# Altium schematic sheet PROC054D_Revision_History.SchDoc: Revision History
size 558 x 431 mm; Date: Not shown in title block; ApprovedBy: Not shown in title block; CheckedBy: Not shown in title block; Author: Not shown in title block; CompanyName: Not shown in title block; DrawnBy: a0271760; Engineer: Not shown in title block; Organization: Not shown in title block; Address1: Not shown in title block; Address2: Not shown in title block; Address3: Not shown in title block; Address4: Not shown in title block; DocumentNumber: 19; Revision: Use project pAWRameter SCH_Rev; SheetNumber: 19; SheetTotal: 19; PageSetup: Record=PageOptions|CenterHorizontal=True|CenterVertical=True|PrintScale=1.00|XCorrection=1.00|YCorrection=1.00|PrintKind=0|BorderSize=5000000|LeftOffset=0|BottomOffset=0|Orientation=2|PaperLength=1000|PaperWidth=1000|Scale=100|PaperSource=15|PrintQuality=600|MediaType=1|DitherType=10|PaperKind=Letter|PrintScaleMode=1; CurrentTime: Not shown in title block; CurrentDate: Not shown in title block; Time: Not shown in title block; DocumentFullPathAndName: Not shown in title block; DocumentName: Not shown in title block; ModifiedDate: Not shown in title block; ImagePath: Not shown in title block
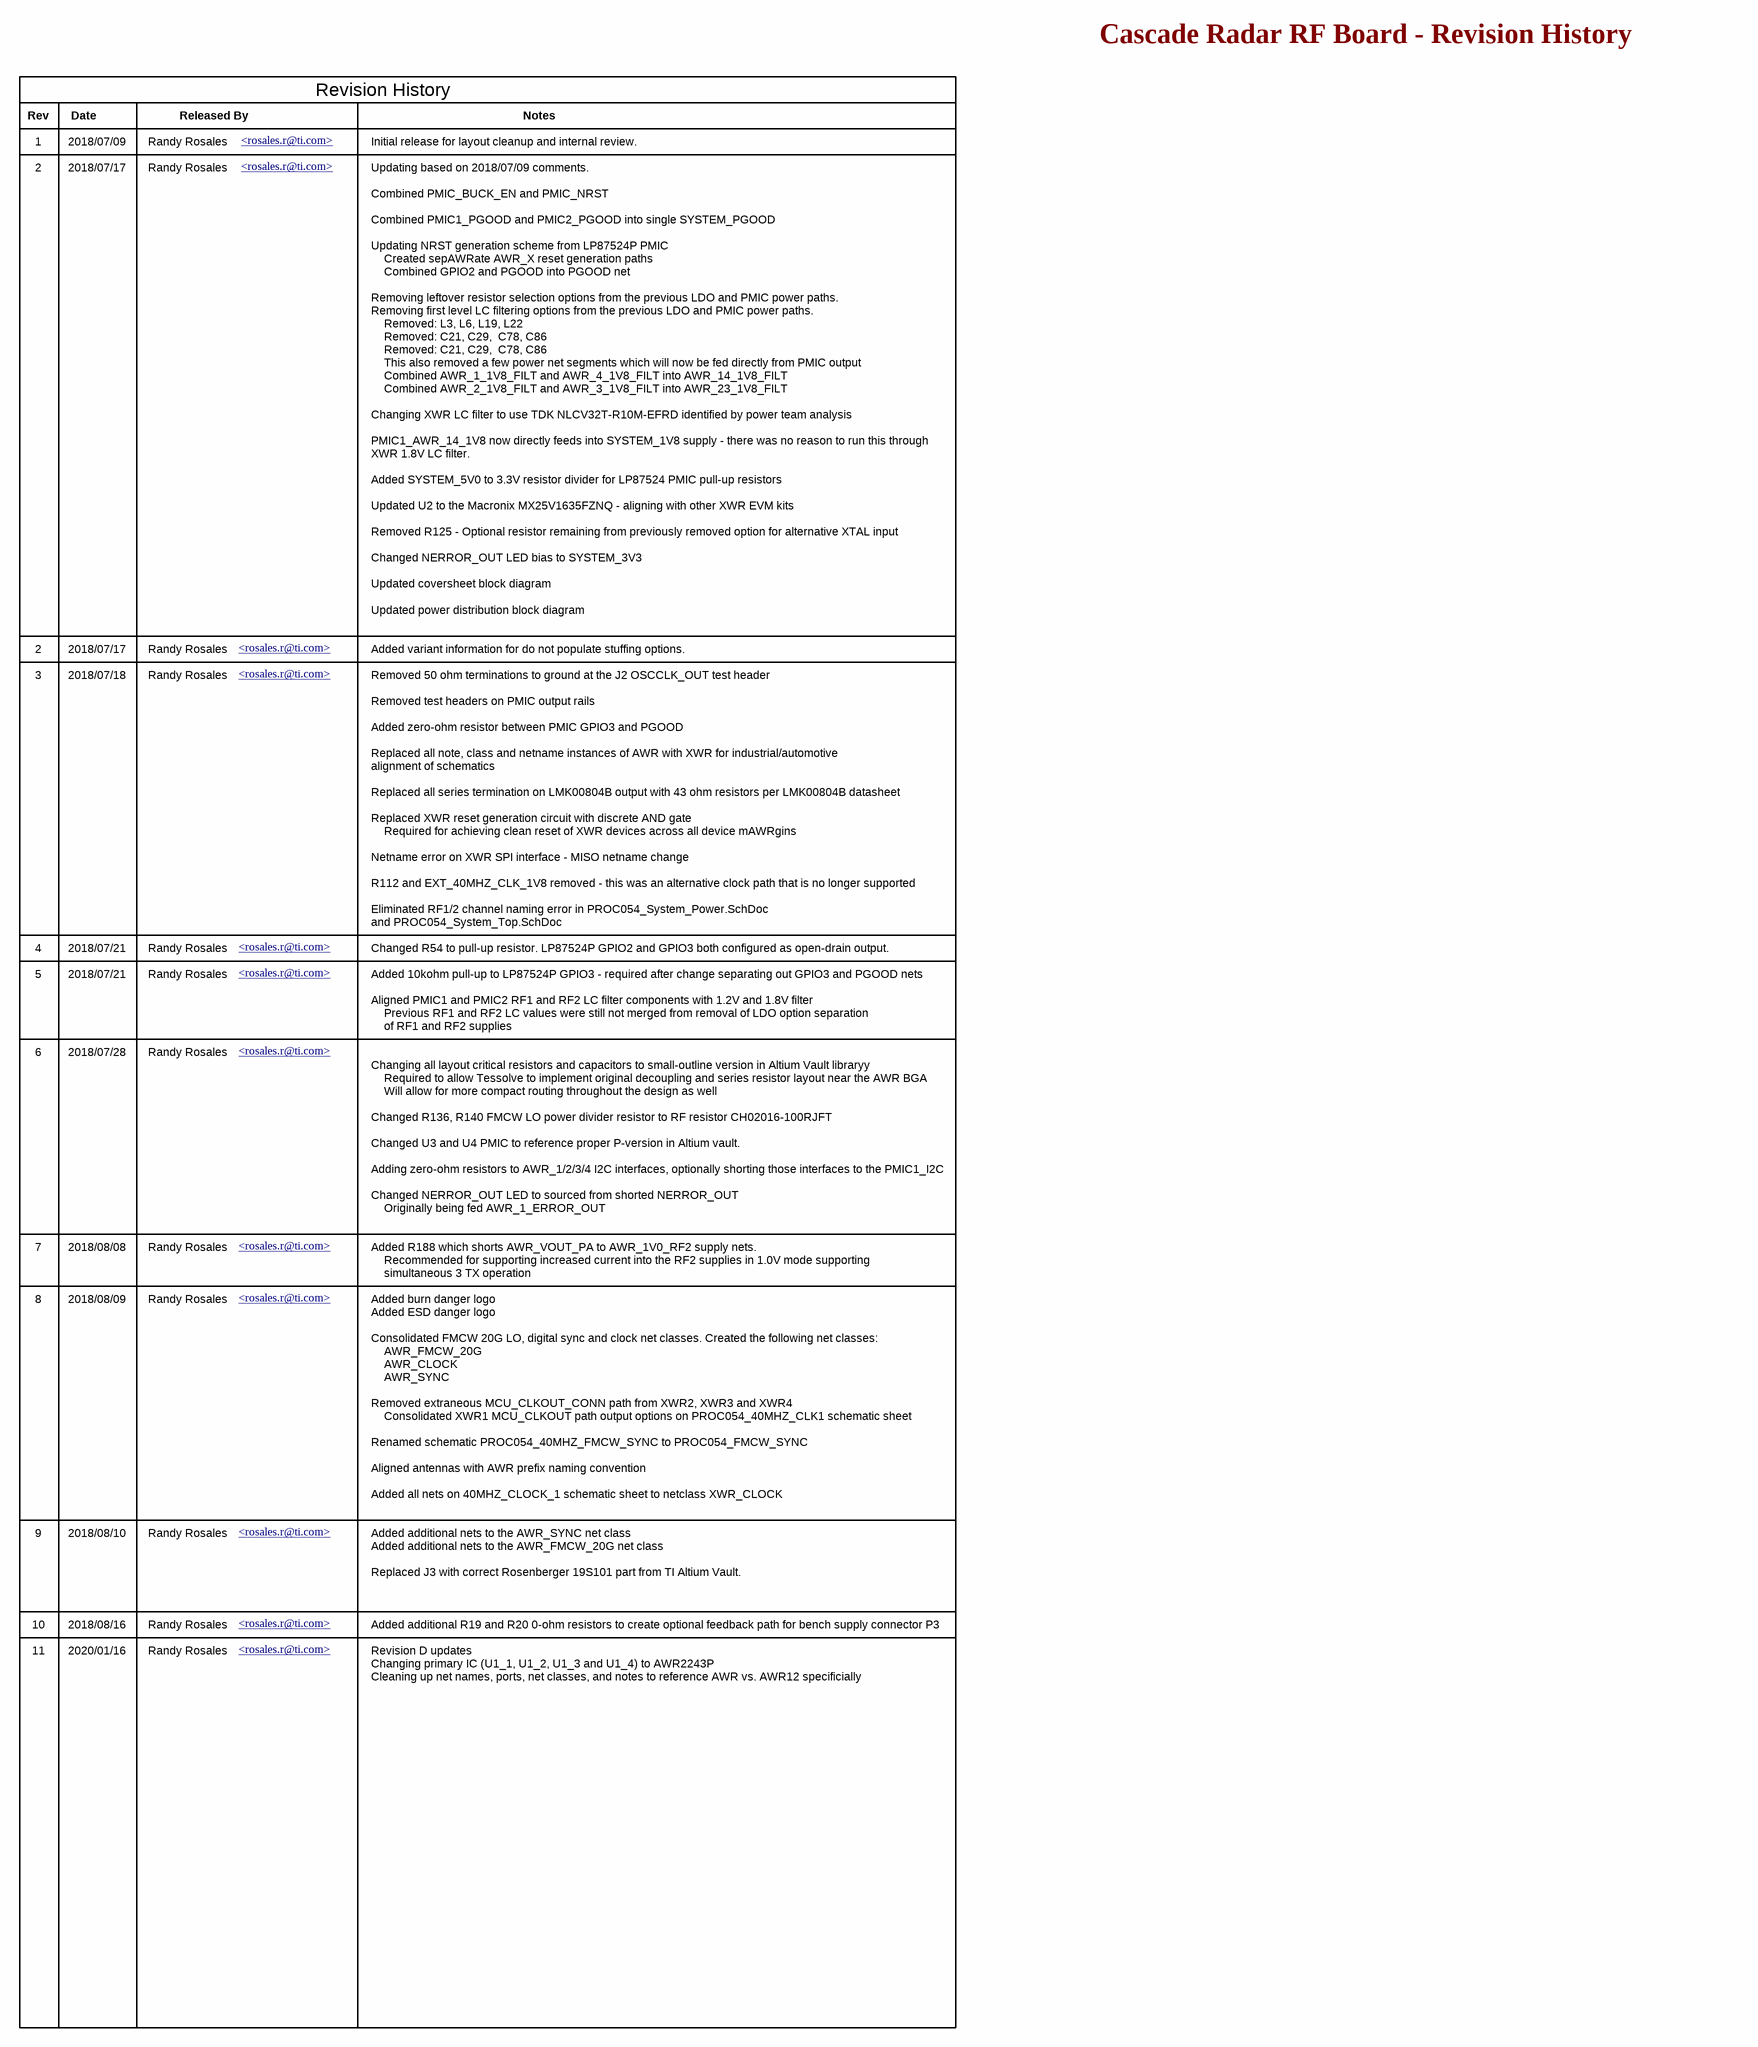
[diagram p0: PROC054D_Revision_History.SchDoc]

## Notes on the sheet
- Cascade Radar RF Board - Revision History
- Rev
- Date
- Released By
- Revision History
- Notes
- 1
- 2
- 2018/07/09
- 2018/07/17
- Randy Rosales
- <rosales.r@ti.com> <rosales.r@ti.com>
- Initial release for layout cleanup and internal review.
- Updating based on 2018/07/09 comments.
- Combined PMIC_BUCK_EN and PMIC_NRST
- Updating NRST generation scheme from LP87524P PMIC
- Combined PMIC1_PGOOD and PMIC2_PGOOD into single SYSTEM_PGOOD
- Created sepAWRate AWR_X reset generation paths
- Removing leftover resistor selection options from the previous LDO and PMIC power paths.
- Removing first level LC filtering options from the previous LDO and PMIC power paths.
- Removed: L3, L6, L19, L22
- Combined GPIO2 and PGOOD into PGOOD net
- Removed: C21, C29,  C78, C86
- This also removed a few power net segments which will now be fed directly from PMIC output
- Combined AWR_1_1V8_FILT and AWR_4_1V8_FILT into AWR_14_1V8_FILT
- Combined AWR_2_1V8_FILT and AWR_3_1V8_FILT into AWR_23_1V8_FILT
- Changing XWR LC filter to use TDK NLCV32T-R10M-EFRD identified by power team analysis
- PMIC1_AWR_14_1V8 now directly feeds into SYSTEM_1V8 supply - there was no reason to run this through
- XWR 1.8V LC filter.
- Updated U2 to the Macronix MX25V1635FZNQ - aligning with other XWR EVM kits
- Added SYSTEM_5V0 to 3.3V resistor divider for LP87524 PMIC pull-up resistors
- Removed R125 - Optional resistor remaining from previously removed option for alternative XTAL input
- Changed NERROR_OUT LED bias to SYSTEM_3V3
- Updated coversheet block diagram
- Updated power distribution block diagram
- Added variant information for do not populate stuffing options.
- 3
- 2018/07/18
- Removed 50 ohm terminations to ground at the J2 OSCCLK_OUT test header
- Removed test headers on PMIC output rails
- Added zero-ohm resistor between PMIC GPIO3 and PGOOD
- Replaced all note, class and netname instances of AWR with XWR for industrial/automotive
- alignment of schematics
- Replaced all series termination on LMK00804B output with 43 ohm resistors per LMK00804B datasheet
- Replaced XWR reset generation circuit with discrete AND gate
- Required for achieving clean reset of XWR devices across all device mAWRgins
- Netname error on XWR SPI interface - MISO netname change
- R112 and EXT_40MHZ_CLK_1V8 removed - this was an alternative clock path that is no longer supported
- Eliminated RF1/2 channel naming error in PROC054_System_Power.SchDoc
- 4
- 5
- 2018/07/21
- Changed R54 to pull-up resistor. LP87524P GPIO2 and GPIO3 both configured as open-drain output.
- and PROC054_System_Top.SchDoc
- Added 10kohm pull-up to LP87524P GPIO3 - required after change separating out GPIO3 and PGOOD nets
- Aligned PMIC1 and PMIC2 RF1 and RF2 LC filter components with 1.2V and 1.8V filter
- Previous RF1 and RF2 LC values were still not merged from removal of LDO option separation
- of RF1 and RF2 supplies
- 6
- 2018/07/28
- Changing all layout critical resistors and capacitors to small-outline version in Altium Vault libraryy
- Required to allow Tessolve to implement original decoupling and series resistor layout near the AWR BGA
- Will allow for more compact routing throughout the design as well
- Adding zero-ohm resistors to AWR_1/2/3/4 I2C interfaces, optionally shorting those interfaces to the PMIC1_I2C
- Changed R136, R140 FMCW LO power divider resistor to RF resistor CH02016-100RJFT
- Changed U3 and U4 PMIC to reference proper P-version in Altium vault.
- Changed NERROR_OUT LED to sourced from shorted NERROR_OUT
- Originally being fed AWR_1_ERROR_OUT
- 7
- 8
- 2018/08/08
- 2018/08/09
- Added R188 which shorts AWR_VOUT_PA to AWR_1V0_RF2 supply nets.
- Added burn danger logo
- Recommended for supporting increased current into the RF2 supplies in 1.0V mode supporting
- simultaneous 3 TX operation
- Added ESD danger logo
- Consolidated FMCW 20G LO, digital sync and clock net classes. Created the following net classes:
- AWR_FMCW_20G
- AWR_CLOCK
- Removed extraneous MCU_CLKOUT_CONN path from XWR2, XWR3 and XWR4
- Consolidated XWR1 MCU_CLKOUT path output options on PROC054_40MHZ_CLK1 schematic sheet
- AWR_SYNC
- Renamed schematic PROC054_40MHZ_FMCW_SYNC to PROC054_FMCW_SYNC
- Aligned antennas with AWR prefix naming convention
- Added all nets on 40MHZ_CLOCK_1 schematic sheet to netclass XWR_CLOCK
- 9
- 2018/08/10
- Added additional nets to the AWR_SYNC net class
- Added additional nets to the AWR_FMCW_20G net class
- 10
- 2018/08/16
- Replaced J3 with correct Rosenberger 19S101 part from TI Altium Vault.
- Added additional R19 and R20 0-ohm resistors to create optional feedback path for bench supply connector P3
- 11
- 2020/01/16
- Changing primary IC (U1_1, U1_2, U1_3 and U1_4) to AWR2243P
- Cleaning up net names, ports, net classes, and notes to reference AWR vs. AWR12 specificially
- Revision D updates
- Drawn By:
- SVN Rev:
- Number:
- TID #:
- Orderable:
- Rev:
- Sheet Title:
- File:
- Project Title:
- Designed for:
- Assembly VAWRiant:
- Mod. Date:
- Sheet:
- Size:
- of
- C
- http://www.ti.com
- Texas Instruments and/or its licensors do not wAWRrant the accuracy or completeness of this specification or any information contained therein. Texas Instruments and/or its licensors do not wAWRrant that this design will meet the specifications, will be suitable for your application or fit for any pAWRticulAWR purpose, or will operate in an implementation. Texas Instruments and/or its licensors do not wAWRrant that the design is production worthy. You should completely validate and test your design implementation to confirm the system functionality for your application.
- Engineer:
- Contact:
- © Texas Instruments